# Altium schematic sheet Power_24V.SchDoc
size A4; DocumentNumber: 2; SheetNumber: 2; SheetTotal: 4
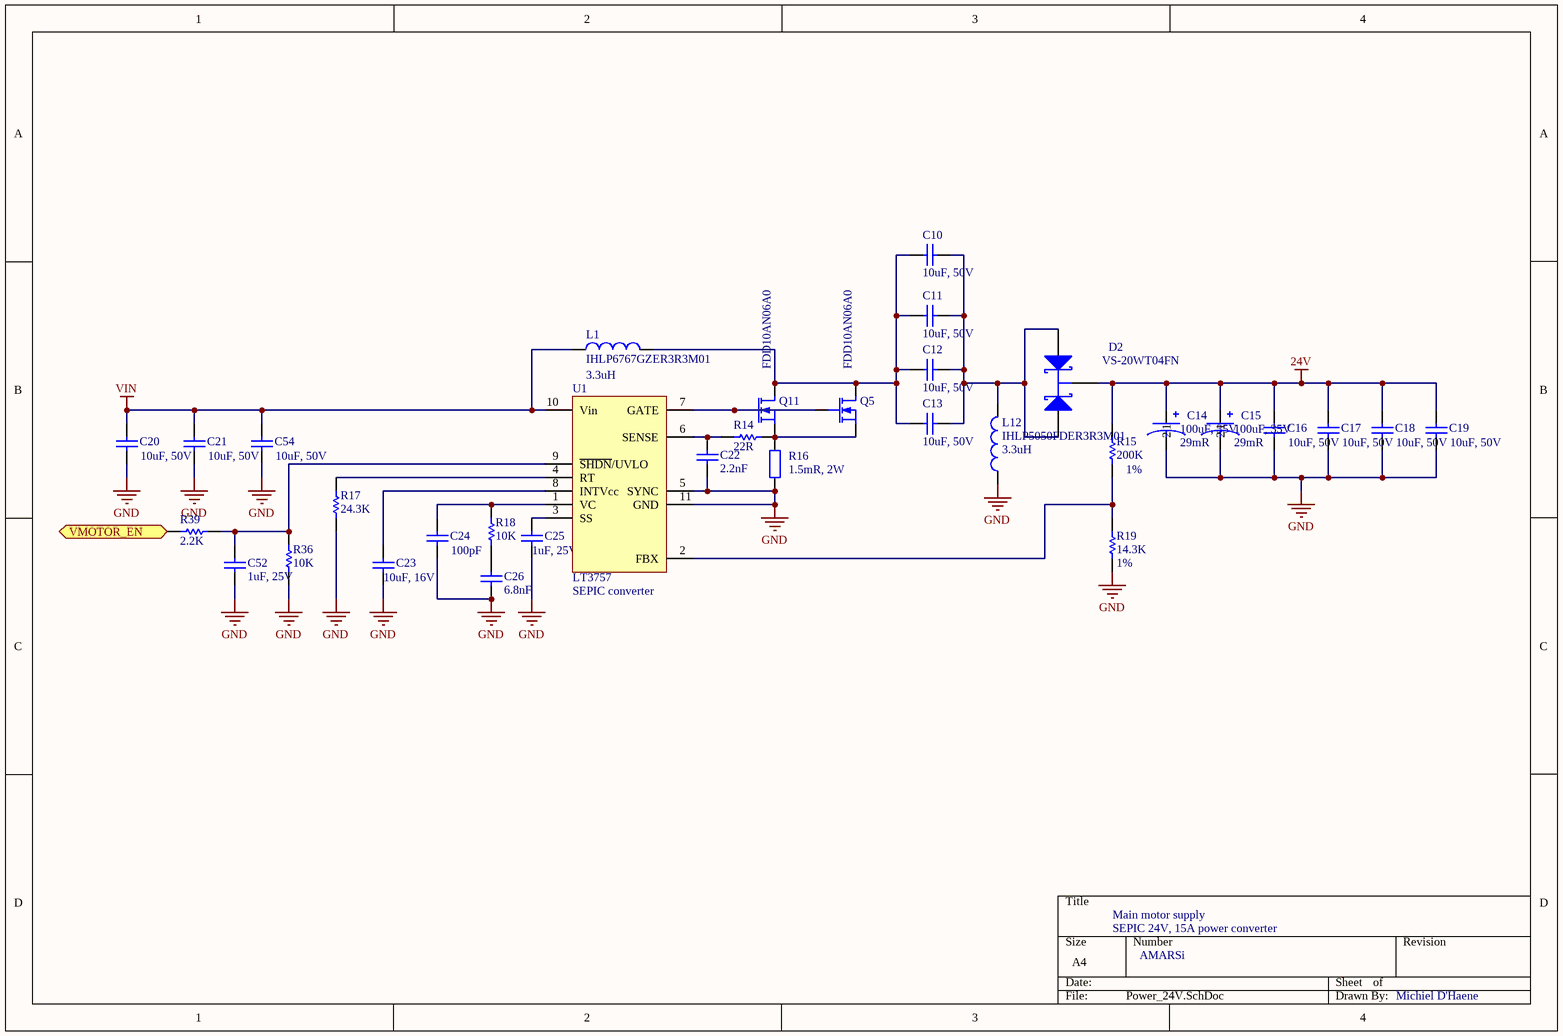
[diagram p0: Power_24V.SchDoc]

## Parts
C10  10uF, 50V  [CAPC3216L]
C11  10uF, 50V  [CAPC3216L]
C12  10uF, 50V  [CAPC3216L]
C13  10uF, 50V  [CAPC3216L]
C14  value 100uF, 35V  ESR: 29mR  [CAP_POL_SMD_SIZE_G]  (hidden comment: 100uF, 35V, 29mR)
C15  value 100uF, 35V  ESR: 29mR  [CAP_POL_SMD_SIZE_G]  (hidden comment: 100uF, 35V, 29mR)
C16  10uF, 50V  [CAPC3216L]
C17  10uF, 50V  [CAPC3216L]
C18  10uF, 50V  [CAPC3216L]
C19  10uF, 50V  [CAPC3216L]
C20  10uF, 50V  [CAPC3216L]
C21  10uF, 50V  [CAPC3216L]
C22  2.2nF  [CAPC1608L]
C23  10uF, 16V  [CAPC2512L]
C24  100pF  [CAPC1608L]
C25  1uF, 25V  [CAPC1608L]
C26  6.8nF  [CAPC1608L]
C52  1uF, 25V  [CAPC1608L]
C54  10uF, 50V  [CAPC3216L]
D2  VS-20WT04FN  [TO-252AA]
L1  IHLP6767GZER3R3M01  value 3.3uH  [IHLP-6767GZ]
L12  IHLP5050FDER3R3M01  value 3.3uH  [IHLP5050]
Q5  FDD10AN06A0  [TO-252A DPak]
Q11  FDD10AN06A0  [TO-252A DPak]
R14  22R  [RESC1608L]
R15  value 200K  Precision: 1%  [RESC1608L]  (hidden comment: 200K, 1%)
R16  1.5mR, 2W  [RESC6332N]
R17  24.3K  [RESC1608L]
R18  10K  [RESC1608L]
R19  value 14.3K  Precision: 1%  [RESC1608L]  (hidden comment: 14.3K, 1%)
R36  10K  [RESC1608L]
R39  2.2k  [RESC1608L]
U1  LT3757  [MSOP-10-TP]

## Ports
VMOTOR_EN

## Nets
24V: C14.2 C15.2 C16.2 C17.2 C18.2 C19.2 D2.4(K) R15.2
GND: C14.1 C15.1 C16.1 C17.1 C18.1 C19.1 C20.1 C21.1 C22.1 C23.1 C24.1 C25.1 C26.1 C52.1 C54.1 L12.1 R16.1 R17.1 R19.1 R36.1 U1.5(SYNC) U1.11(GND)
VIN: C20.2 C21.2 C54.2 L1.1 U1.10(Vin)
VMOTOR_EN: R39.2 ; port VMOTOR_EN
NetC10_1: C10.1 C11.1 C12.1 C13.1 D2.1(A1) D2.3(A2) L12.2
NetC10_2: C10.2 C11.2 C12.2 C13.2 L1.2 Q5.D Q11.D
NetC22_2: C22.2 R14.1 U1.6(SENSE)
NetC23_2: C23.2 U1.8(INTVcc)
NetC24_2: C24.2 R18.2 U1.1(VC)
NetC25_2: C25.2 U1.3(SS)
NetC26_2: C26.2 R18.1
NetC52_2: C52.2 R36.2 R39.1 U1.9(~{SHDN}/UVLO)
NetQ5_G: Q5.G Q11.G U1.7(GATE)
NetQ5_S: Q5.S Q11.S R14.2 R16.2
NetR15_1: R15.1 R19.2 U1.2(FBX)
NetR17_2: R17.2 U1.4(RT)

## Notes on the sheet
- (near U1) SEPIC converter
- Main motor supply
- SEPIC 24V, 15A power converter
- AMARSi
- Michiel D'Haene

## Library data of the parts
C10-C13 C16-C22 C52 C54 = Cap Semi: Capacitor (Semiconductor SIM Model); Published: 8-Jun-2000; LatestRevisionDate: 29-May-2009; LatestRevisionNote: IPC-7351 Footprint Added.; PackageReference: C1206; Publisher: Altium Limited; PackageDescription: Chip Capacitor
  C10-C13 C16-C21 C54: Value: 10uF; Voltage: 50V
  C22: Value: 2.2nF
  C52: Value: 1uF, 25V
C14 C15 = CAP_POL
C23 = Cap Semi: Capacitor (Semiconductor SIM Model); Voltage: 10V; Published: 8-Jun-2000; LatestRevisionDate: 29-May-2009; LatestRevisionNote: IPC-7351 Footprint Added.; PackageReference: C0805; Publisher: Altium Limited; PackageDescription: Chip Capacitor; Value: 10uF
C24-C26 = Cap: Capacitor; Published: 8-Jun-2000; LatestRevisionDate: 17-Jul-2002; LatestRevisionNote: Re-released for DXP Platform.; PackageReference: RAD-0.3; Publisher: Altium Limited
  C25: Value: 1uF, 25V
D2 = 12CWQ06FN: Schottky Rectifier; Note: Pin 2 is trimmed and not drawn; Published: 8-Jun-2000; LatestRevisionDate: 17-Jul-2002; LatestRevisionNote: Re-released for DXP Platform.; DatasheetDocument: Apr-1997; PackageDocument: Feb-2003; PackageReference: TO-252AA; Publisher: Altium Limited; Code_JEDEC: TO-252-AA; ComponentLink1Description: Manufacturer Link; ComponentLink1URL: http://www.irf.com/; ComponentLink2Description: Datasheet; ComponentLink2URL: http://www.irf.com/product-info/datasheets/data/12cwq06fn.pdf
L1 = Inductor
L12 = Inductor: Code_IEC: 1005; Published: 8-Jun-2000; LatestRevisionDate: 17-Jul-2002; LatestRevisionNote: Re-released for DXP Platform.; PackageReference: 0402-A; Publisher: Altium Limited; Code_JEITA: 0402
Q5 Q11 = nFET: N-Channel MOSFET; pin to pad: D>4 G>1 S>3
R14 R15 R17-R19 R36 = Res Semi: Semiconductor Resistor; Published: 8-Jun-2000; LatestRevisionDate: 17-Jul-2002; LatestRevisionNote: Re-released for DXP Platform.; PackageReference: AXIAL-0.5; Publisher: Altium Limited
  R14: Value: 22R
  R17: Value: 24.3K
  R18 R36: Value: 10K
R16 = Res2: Resistor; Published: 8-Jun-2000; LatestRevisionDate: 17-Jul-2002; LatestRevisionNote: Re-released for DXP Platform.; PackageReference: AXIAL-0.4; Publisher: Altium Limited; Value: 1.5mR, 2W
R39 = Res Semi: Semiconductor Resistor; Precision: 5%; Published: 8-Jun-2000; LatestRevisionDate: 17-Jul-2002; LatestRevisionNote: Re-released for DXP Platform.; PackageReference: AXIAL-0.5; Publisher: Altium Limited; Value: 2.2K
U1 = LT3757: 2.9-40V SEPIC, Flyback, Boost and Inverting Converter with external switch